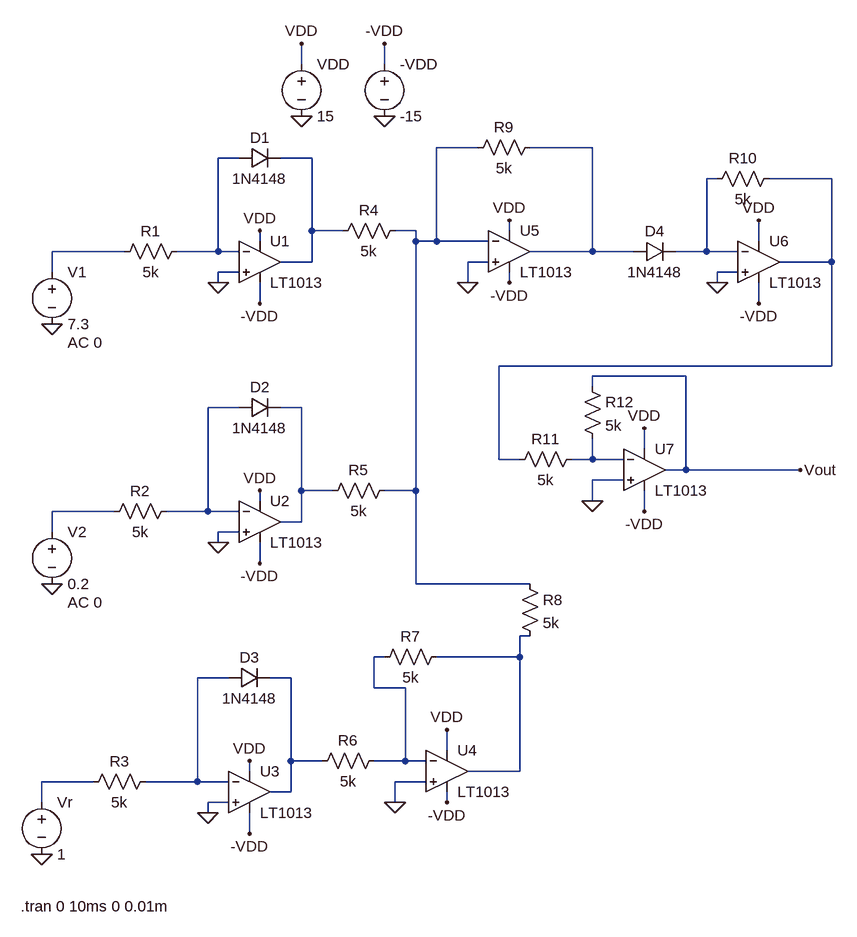
[diagram p0: schematic Multiplier_Circuit.asc]
Multiplier_Circuit.asc, the LTspice schematic file:
Version 4.1
SHEET 1 888 1344
WIRE 48 32 48 0
WIRE 176 32 176 0
WIRE 320 160 256 160
WIRE 496 160 400 160
WIRE -48 176 -80 176
WIRE 64 176 16 176
WIRE 688 208 672 208
WIRE 864 208 768 208
WIRE 64 288 64 176
WIRE 112 288 64 288
WIRE 224 288 192 288
WIRE 368 288 368 272
WIRE -16 304 -16 288
WIRE 224 304 224 288
WIRE 256 304 256 160
WIRE 256 304 224 304
WIRE 336 304 256 304
WIRE 752 304 752 272
WIRE -224 320 -336 320
WIRE -80 320 -80 176
WIRE -80 320 -144 320
WIRE -48 320 -80 320
WIRE 496 320 496 160
WIRE 496 320 400 320
WIRE 560 320 496 320
WIRE 672 320 672 208
WIRE 672 320 624 320
WIRE 720 320 672 320
WIRE 64 336 64 288
WIRE 64 336 16 336
WIRE 336 336 304 336
WIRE 864 336 864 208
WIRE 864 336 784 336
WIRE -336 352 -336 320
WIRE -48 352 -80 352
WIRE 720 352 688 352
WIRE -80 368 -80 352
WIRE 304 368 304 336
WIRE 368 368 368 352
WIRE 688 368 688 352
WIRE -16 400 -16 368
WIRE 752 400 752 368
WIRE 864 496 864 336
WIRE 864 496 352 496
WIRE 640 512 496 512
WIRE 496 528 496 512
WIRE -48 560 -96 560
WIRE 48 560 16 560
WIRE 576 624 576 592
WIRE 352 640 352 496
WIRE 384 640 352 640
WIRE 496 640 496 608
WIRE 496 640 464 640
WIRE 544 640 496 640
WIRE 640 656 640 512
WIRE 640 656 608 656
WIRE 816 656 640 656
WIRE 544 672 496 672
WIRE 48 688 48 560
WIRE 96 688 48 688
WIRE 224 688 224 304
WIRE 224 688 176 688
WIRE -16 704 -16 688
WIRE 496 704 496 672
WIRE -240 720 -336 720
WIRE -96 720 -96 560
WIRE -96 720 -160 720
WIRE -48 720 -96 720
WIRE 576 720 576 688
WIRE 48 736 48 688
WIRE 48 736 16 736
WIRE -336 752 -336 720
WIRE -48 752 -80 752
WIRE -80 768 -80 752
WIRE -16 800 -16 768
WIRE 224 832 224 688
WIRE 400 832 224 832
WIRE 400 912 384 912
WIRE 176 944 160 944
WIRE 384 944 384 912
WIRE 384 944 256 944
WIRE -64 976 -112 976
WIRE 32 976 0 976
WIRE 160 992 160 944
WIRE 208 992 160 992
WIRE 272 1088 272 1056
WIRE 32 1104 32 976
WIRE 80 1104 32 1104
WIRE 208 1104 208 992
WIRE 208 1104 160 1104
WIRE 240 1104 208 1104
WIRE -32 1120 -32 1104
WIRE 384 1120 384 944
WIRE 384 1120 304 1120
WIRE -272 1136 -352 1136
WIRE -112 1136 -112 976
WIRE -112 1136 -192 1136
WIRE -64 1136 -112 1136
WIRE 240 1136 192 1136
WIRE 32 1152 32 1104
WIRE 32 1152 0 1152
WIRE -352 1168 -352 1136
WIRE -64 1168 -96 1168
WIRE 192 1168 192 1136
WIRE 272 1168 272 1152
WIRE -96 1184 -96 1168
WIRE -32 1216 -32 1184
FLAG 48 112 0
FLAG 176 112 0
FLAG 48 0 VDD
FLAG 176 0 -VDD
FLAG -80 368 0
FLAG -80 768 0
FLAG -96 1184 0
FLAG -336 432 0
FLAG -336 832 0
FLAG -352 1248 0
FLAG -16 288 VDD
FLAG -16 400 -VDD
FLAG -16 688 VDD
FLAG -16 800 -VDD
FLAG -32 1104 VDD
FLAG -32 1216 -VDD
FLAG 192 1168 0
FLAG 304 368 0
FLAG 368 272 VDD
FLAG 368 368 -VDD
FLAG 272 1168 -VDD
FLAG 272 1056 VDD
FLAG 688 368 0
FLAG 752 400 -VDD
FLAG 752 272 VDD
FLAG 576 592 VDD
FLAG 576 720 -VDD
FLAG 816 656 Vout
FLAG 496 704 0
SYMBOL voltage 48 16 R0
SYMATTR InstName VDD
SYMATTR Value 15
SYMBOL voltage 176 16 R0
SYMATTR InstName -VDD
SYMATTR Value -15
SYMBOL voltage -336 336 R0
WINDOW 123 24 124 Left 2
WINDOW 39 0 0 Left 0
SYMATTR Value2 AC 0
SYMATTR InstName V1
SYMATTR Value 7.3
SYMBOL voltage -336 736 R0
WINDOW 123 24 124 Left 2
WINDOW 39 0 0 Left 0
SYMATTR Value2 AC 0
SYMATTR InstName V2
SYMATTR Value 0.2
SYMBOL res -128 304 R90
WINDOW 0 0 56 VBottom 2
WINDOW 3 32 56 VTop 2
SYMATTR InstName R1
SYMATTR Value 5k
SYMBOL res -144 704 R90
WINDOW 0 0 56 VBottom 2
WINDOW 3 32 56 VTop 2
SYMATTR InstName R2
SYMATTR Value 5k
SYMBOL res -176 1120 R90
WINDOW 0 0 56 VBottom 2
WINDOW 3 32 56 VTop 2
SYMATTR InstName R3
SYMATTR Value 5k
SYMBOL OpAmps\\LT1013 -16 272 R0
SYMATTR InstName U1
SYMBOL OpAmps\\LT1013 -16 672 R0
SYMATTR InstName U2
SYMBOL OpAmps\\LT1013 -32 1088 R0
SYMATTR InstName U3
SYMBOL diode -48 192 R270
WINDOW 0 32 32 VTop 2
WINDOW 3 0 32 VBottom 2
SYMATTR InstName D1
SYMATTR Value 1N4148
SYMBOL diode -48 576 R270
WINDOW 0 32 32 VTop 2
WINDOW 3 0 32 VBottom 2
SYMATTR InstName D2
SYMATTR Value 1N4148
SYMBOL diode -64 992 R270
WINDOW 0 32 32 VTop 2
WINDOW 3 0 32 VBottom 2
SYMATTR InstName D3
SYMATTR Value 1N4148
SYMBOL res 208 272 R90
WINDOW 0 0 56 VBottom 2
WINDOW 3 32 56 VTop 2
SYMATTR InstName R4
SYMATTR Value 5k
SYMBOL res 192 672 R90
WINDOW 0 0 56 VBottom 2
WINDOW 3 32 56 VTop 2
SYMATTR InstName R5
SYMATTR Value 5k
SYMBOL res 176 1088 R90
WINDOW 0 0 56 VBottom 2
WINDOW 3 32 56 VTop 2
SYMATTR InstName R6
SYMATTR Value 5k
SYMBOL OpAmps\\LT1013 272 1056 R0
SYMATTR InstName U4
SYMBOL res 272 928 R90
WINDOW 0 0 56 VBottom 2
WINDOW 3 32 56 VTop 2
SYMATTR InstName R7
SYMATTR Value 5k
SYMBOL res 384 816 R0
SYMATTR InstName R8
SYMATTR Value 5k
SYMBOL OpAmps\\LT1013 368 256 R0
SYMATTR InstName U5
SYMBOL res 416 144 R90
WINDOW 0 0 56 VBottom 2
WINDOW 3 32 56 VTop 2
SYMATTR InstName R9
SYMATTR Value 5k
SYMBOL diode 560 336 R270
WINDOW 0 32 32 VTop 2
WINDOW 3 0 32 VBottom 2
SYMATTR InstName D4
SYMATTR Value 1N4148
SYMBOL OpAmps\\LT1013 752 272 R0
SYMATTR InstName U6
SYMBOL res 672 224 R270
WINDOW 0 32 56 VTop 2
WINDOW 3 0 56 VBottom 2
SYMATTR InstName R10
SYMATTR Value 5k
SYMBOL OpAmps\\LT1013 576 592 R0
SYMATTR InstName U7
SYMBOL res 480 624 R90
WINDOW 0 0 56 VBottom 2
WINDOW 3 32 56 VTop 2
SYMATTR InstName R11
SYMATTR Value 5k
SYMBOL res 480 512 R0
SYMATTR InstName R12
SYMATTR Value 5k
SYMBOL voltage -352 1152 R0
SYMATTR InstName Vr
SYMATTR Value 1
TEXT -384 1328 Left 2 !.tran 0 10ms 0 0.01m

The netlist it stands for:
* Multiplier_Circuit.asc
VDD VDD 0 15
V§-VDD -VDD 0 -15
V1 N007 0 7.3 AC 0
V2 N011 0 0.2 AC 0
R1 N003 N007 5k
R2 N008 N011 5k
R3 N014 N016 5k
X§U1 0 N003 VDD -VDD N004 LT1013  ; pins In+ In- V+ V- OUT
X§U2 0 N008 VDD -VDD N009 LT1013  ; pins In+ In- V+ V- OUT
X§U3 0 N014 VDD -VDD N015 LT1013  ; pins In+ In- V+ V- OUT
D1 N003 N004 1N4148
D2 N008 N009 1N4148
D3 N014 N015 1N4148
R4 N001 N004 5k
R5 N001 N009 5k
R6 N013 N015 5k
X§U4 0 N013 VDD -VDD N012 LT1013  ; pins In+ In- V+ V- OUT
R7 N012 N013 5k
R8 N001 N012 5k
X§U5 0 N001 VDD -VDD N002 LT1013  ; pins In+ In- V+ V- OUT
R9 N002 N001 5k
D4 N002 N005 1N4148
X§U6 0 N005 VDD -VDD N006 LT1013  ; pins In+ In- V+ V- OUT
R10 N005 N006 5k
X§U7 0 N010 VDD -VDD Vout LT1013  ; pins In+ In- V+ V- OUT
R11 N010 N006 5k
R12 Vout N010 5k
Vr N016 0 1
.model D D
.lib standard.dio
.tran 0 10ms 0 0.01m
.lib LTC.lib
.backanno
.end